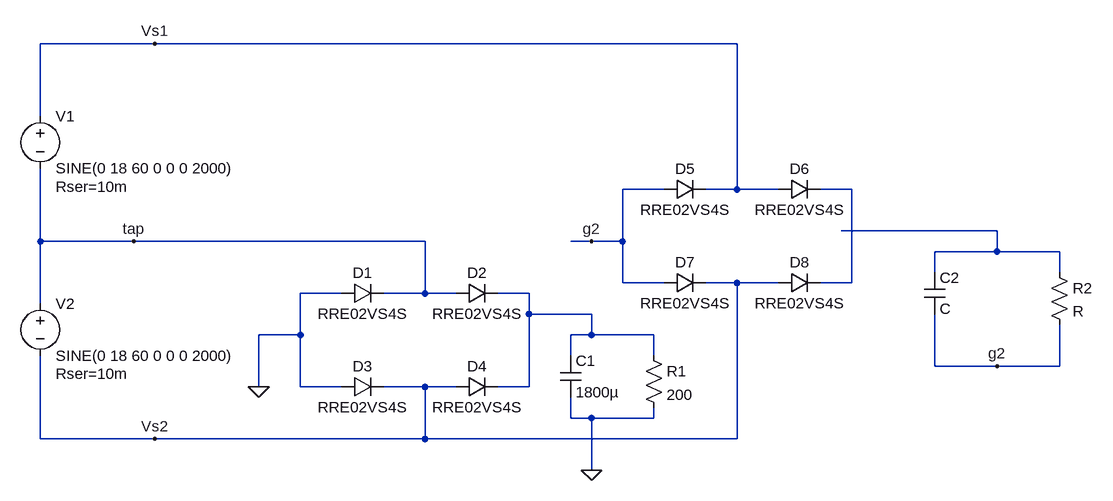
[diagram p0: schematic Draft1.asc]
Draft1.asc, the LTspice schematic file:
Version 4
SHEET 1 1640 680
WIRE 192 -144 16 -144
WIRE 1088 -144 192 -144
WIRE 16 -32 16 -144
WIRE 976 80 912 80
WIRE 1088 80 1088 -144
WIRE 1088 80 1040 80
WIRE 1152 80 1088 80
WIRE 1264 80 1216 80
WIRE 1488 144 1248 144
WIRE 16 160 16 48
WIRE 160 160 16 160
WIRE 608 160 160 160
WIRE 864 160 832 160
WIRE 912 160 912 80
WIRE 912 160 864 160
WIRE 1488 176 1488 144
WIRE 1488 176 1392 176
WIRE 1584 176 1488 176
WIRE 1392 208 1392 176
WIRE 1584 208 1584 176
WIRE 912 224 912 160
WIRE 976 224 912 224
WIRE 1088 224 1040 224
WIRE 1152 224 1088 224
WIRE 1264 224 1264 80
WIRE 1264 224 1216 224
WIRE 480 240 416 240
WIRE 608 240 608 160
WIRE 608 240 544 240
WIRE 656 240 608 240
WIRE 768 240 720 240
WIRE 16 256 16 160
WIRE 768 272 768 240
WIRE 864 272 768 272
WIRE 416 304 416 240
WIRE 416 304 352 304
WIRE 864 304 864 272
WIRE 864 304 832 304
WIRE 960 304 864 304
WIRE 832 336 832 304
WIRE 960 336 960 304
WIRE 1392 352 1392 272
WIRE 1488 352 1392 352
WIRE 1584 352 1584 288
WIRE 1584 352 1488 352
WIRE 352 384 352 304
WIRE 416 384 416 304
WIRE 480 384 416 384
WIRE 608 384 544 384
WIRE 656 384 608 384
WIRE 768 384 768 272
WIRE 768 384 720 384
WIRE 832 432 832 400
WIRE 864 432 832 432
WIRE 960 432 960 416
WIRE 960 432 864 432
WIRE 16 464 16 336
WIRE 192 464 16 464
WIRE 608 464 608 384
WIRE 608 464 192 464
WIRE 1088 464 1088 224
WIRE 1088 464 608 464
WIRE 864 512 864 432
FLAG 160 160 tap
FLAG 192 -144 Vs1
FLAG 192 464 Vs2
FLAG 352 384 0
FLAG 864 160 g2
FLAG 864 512 0
FLAG 1488 352 g2
SYMBOL voltage 16 240 R0
WINDOW 123 0 0 Left 0
WINDOW 39 24 124 Left 2
SYMATTR InstName V2
SYMATTR Value SINE(0 18 60 0 0 0 2000)
SYMATTR SpiceLine Rser=10m
SYMBOL voltage 16 -48 R0
WINDOW 123 0 0 Left 0
WINDOW 39 24 124 Left 2
SYMATTR InstName V1
SYMATTR Value SINE(0 18 60 0 0 0 2000)
SYMATTR SpiceLine Rser=10m
SYMBOL diode 480 256 R270
WINDOW 0 32 32 VTop 2
WINDOW 3 0 32 VBottom 2
SYMATTR InstName D1
SYMATTR Value RRE02VS4S
SYMBOL diode 656 256 R270
WINDOW 0 32 32 VTop 2
WINDOW 3 0 32 VBottom 2
SYMATTR InstName D2
SYMATTR Value RRE02VS4S
SYMBOL diode 480 400 R270
WINDOW 0 32 32 VTop 2
WINDOW 3 0 32 VBottom 2
SYMATTR InstName D3
SYMATTR Value RRE02VS4S
SYMBOL diode 656 400 R270
WINDOW 0 32 32 VTop 2
WINDOW 3 0 32 VBottom 2
SYMATTR InstName D4
SYMATTR Value RRE02VS4S
SYMBOL diode 976 96 R270
WINDOW 0 32 32 VTop 2
WINDOW 3 0 32 VBottom 2
SYMATTR InstName D5
SYMATTR Value RRE02VS4S
SYMBOL diode 1152 96 R270
WINDOW 0 32 32 VTop 2
WINDOW 3 0 32 VBottom 2
SYMATTR InstName D6
SYMATTR Value RRE02VS4S
SYMBOL diode 976 240 R270
WINDOW 0 32 32 VTop 2
WINDOW 3 0 32 VBottom 2
SYMATTR InstName D7
SYMATTR Value RRE02VS4S
SYMBOL diode 1152 240 R270
WINDOW 0 32 32 VTop 2
WINDOW 3 0 32 VBottom 2
SYMATTR InstName D8
SYMATTR Value RRE02VS4S
SYMBOL cap 816 336 R0
SYMATTR InstName C1
SYMATTR Value 1800µ
SYMBOL res 944 320 R0
SYMATTR InstName R1
SYMATTR Value 200
SYMBOL res 1568 192 R0
SYMATTR InstName R2
SYMBOL cap 1376 208 R0
SYMATTR InstName C2

The netlist it stands for:
* Draft1.asc
V2 tap Vs2 SINE(0 18 60 0 0 0 2000) Rser=10m
V1 Vs1 tap SINE(0 18 60 0 0 0 2000) Rser=10m
D1 0 tap RRE02VS4S
D2 tap N003 RRE02VS4S
D3 0 Vs2 RRE02VS4S
D4 Vs2 N003 RRE02VS4S
D5 g2 Vs1 RRE02VS4S
D6 Vs1 N001 RRE02VS4S
D7 g2 Vs2 RRE02VS4S
D8 Vs2 N001 RRE02VS4S
C1 N003 0 1800µ
R1 N003 0 200
R2 N002 g2 R
C2 N002 g2 C
.model D D
.lib standard.dio
.backanno
.end